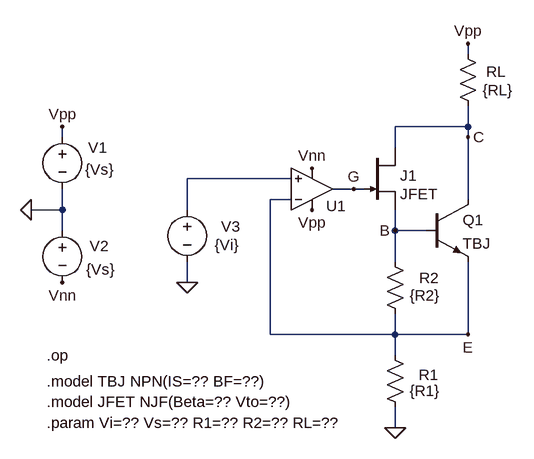
[diagram p0: schematic COMB06opFig.asc]
COMB06opFig.asc, the LTspice schematic file:
Version 4
SHEET 1 2180 1076
WIRE 976 -256 976 -272
WIRE 976 -144 976 -176
WIRE 976 -144 864 -144
WIRE 352 -128 352 -144
WIRE 976 -128 976 -144
WIRE 864 -112 864 -144
WIRE 704 -64 544 -64
WIRE 800 -48 768 -48
WIRE 816 -48 800 -48
WIRE 704 -32 672 -32
WIRE 976 -32 976 -128
WIRE 352 -16 352 -48
WIRE 352 -16 304 -16
WIRE 544 -16 544 -64
WIRE 352 16 352 -16
WIRE 864 16 864 -16
WIRE 912 16 864 16
WIRE 864 64 864 16
WIRE 544 96 544 64
WIRE 672 176 672 -32
WIRE 864 176 864 144
WIRE 864 176 672 176
WIRE 976 176 976 64
WIRE 976 176 864 176
WIRE 864 208 864 176
WIRE 864 320 864 288
FLAG 864 320 0
FLAG 864 16 B
FLAG 976 -128 C
FLAG 800 -48 G
FLAG 352 -144 Vpp
FLAG 304 -16 0
FLAG 352 96 Vnn
FLAG 736 -16 Vpp
FLAG 736 -80 Vnn
FLAG 976 -272 Vpp
FLAG 976 176 E
FLAG 544 96 0
SYMBOL njf 816 -112 R0
WINDOW 0 56 43 Left 2
SYMATTR InstName J1
SYMATTR Value JFET
SYMBOL res 848 48 R0
WINDOW 0 53 41 Left 2
WINDOW 3 38 68 Left 2
SYMATTR InstName R2
SYMATTR Value {R2}
SYMBOL res 960 -272 R0
WINDOW 0 44 43 Left 2
WINDOW 3 39 72 Left 2
SYMATTR InstName RL
SYMATTR Value {RL}
SYMBOL npn 912 -32 R0
SYMATTR InstName Q1
SYMATTR Value TBJ
SYMBOL res 848 192 R0
WINDOW 0 52 46 Left 2
WINDOW 3 38 71 Left 2
SYMATTR InstName R1
SYMATTR Value {R1}
SYMBOL OpAmps\\UniversalOpAmp2 736 -48 M180
WINDOW 0 22 -26 Left 2
SYMATTR InstName U1
SYMBOL voltage 352 -144 R0
WINDOW 123 0 0 Left 0
WINDOW 39 0 0 Left 0
WINDOW 0 40 32 Left 2
WINDOW 3 35 66 Left 2
SYMATTR InstName V1
SYMATTR Value {Vs}
SYMBOL voltage 352 0 R0
WINDOW 123 0 0 Left 0
WINDOW 39 0 0 Left 0
WINDOW 0 42 40 Left 2
WINDOW 3 37 76 Left 2
SYMATTR InstName V2
SYMATTR Value {Vs}
SYMBOL voltage 544 -32 R0
WINDOW 123 0 0 Left 0
WINDOW 39 0 0 Left 0
WINDOW 0 52 42 Left 2
WINDOW 3 42 70 Left 2
SYMATTR InstName V3
SYMATTR Value {Vi}
TEXT 328 208 Left 2 !.op
TEXT 328 280 Left 2 !.model JFET NJF(Beta=?? Vto=??)
TEXT 328 312 Left 2 !.param Vi=?? Vs=?? R1=?? R2=?? RL=??
TEXT 328 248 Left 2 !.model TBJ NPN(IS=?? BF=??)

The netlist it stands for:
* COMB06opFig.asc
J1 C G B JFET
R2 B E {R2}
RL Vpp C {RL}
Q1 C B E 0 TBJ
R1 E 0 {R1}
XU1 N001 E Vpp Vnn G level2 Avol=1Meg GBW=10Meg Slew=10Meg Ilimit=25m Rail=0 Vos=0 En=0 Enk=0 In=0 Ink=0 Rin=500Meg  ; pins In+ In- V+ V- OUT
V1 Vpp 0 {Vs}
V2 0 Vnn {Vs}
V3 N001 0 {Vi}
.model NPN NPN
.model PNP PNP
.lib standard.bjt
.model NJF NJF
.model PJF PJF
.lib standard.jft
.op
.model JFET NJF(Beta=?? Vto=??)
.param Vi=?? Vs=?? R1=?? R2=?? RL=??
.model TBJ NPN(IS=?? BF=??)
.lib UniversalOpAmp2.lib
.backanno
.end